# Altium project Optisk_ut.PrjPcb
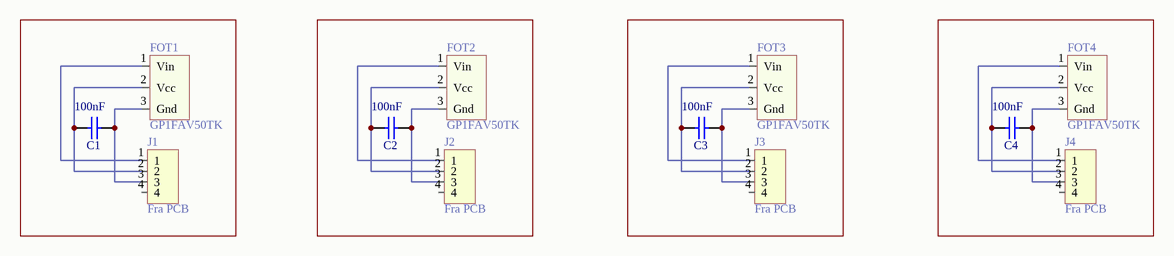
[diagram p0: Optisk_ut.SchDoc]
1 sheet, 12 parts. Net scope: global (net labels, ports and power ports of the same name join across sheets).
Board file: Optisk_ut.PcbDoc

## Sheet Optisk_ut.SchDoc
size A4

### Parts
C1  100nF  [CAPC0805(2012)100_L]
C2  100nF  [CAPC0805(2012)100_L]
C3  100nF  [CAPC0805(2012)100_L]
C4  100nF  [CAPC0805(2012)100_L]
FOT1  GP1FAV50TK  [GP1FAV50TK]
FOT2  GP1FAV50TK  [GP1FAV50TK]
FOT3  GP1FAV50TK  [GP1FAV50TK]
FOT4  GP1FAV50TK  [GP1FAV50TK]
J1  Fra PCB  [JST 4pin]
J2  Fra PCB  [JST 4pin]
J3  Fra PCB  [JST 4pin]
J4  Fra PCB  [JST 4pin]

### Nets
NetC1_1: C1.1 FOT1.2(Vcc) J1.2
NetC1_2: C1.2 FOT1.3(Gnd) J1.3
NetC2_1: C2.1 FOT2.2(Vcc) J2.2
NetC2_2: C2.2 FOT2.3(Gnd) J2.3
NetC3_1: C3.1 FOT3.2(Vcc) J3.2
NetC3_2: C3.2 FOT3.3(Gnd) J3.3
NetC4_1: C4.1 FOT4.2(Vcc) J4.2
NetC4_2: C4.2 FOT4.3(Gnd) J4.3
NetFOT1_1: FOT1.1(Vin) J1.1
NetFOT2_1: FOT2.1(Vin) J2.1
NetFOT3_1: FOT3.1(Vin) J3.1
NetFOT4_1: FOT4.1(Vin) J4.1

Not connected (* = marked no-connect by the designer): J1 4; J2 4; J3 4; J4 4

### Library data of the parts
C1-C4 = CMP-1036-04418-1: CAP 100nF 50V ±5% 0805 (2012 Metric) Thickness 1mm SMD; Case-EIA: 0805; Case-Metric: 2012; Tolerance: ±5%; Max Thickness: 1 mm; Technology: SMT; Value: 100nF; Rated Voltage: 50 V
J1-J4 = JST 4pin
FOT1-FOT4 = GP1FAV50TK: Farnell ID: 1243864; Datasheet: http://www.farnell.com/datasheets/1496758.pdf